# EAGLE schematic Chassis Board V2 (EAGLE 9.1.3)
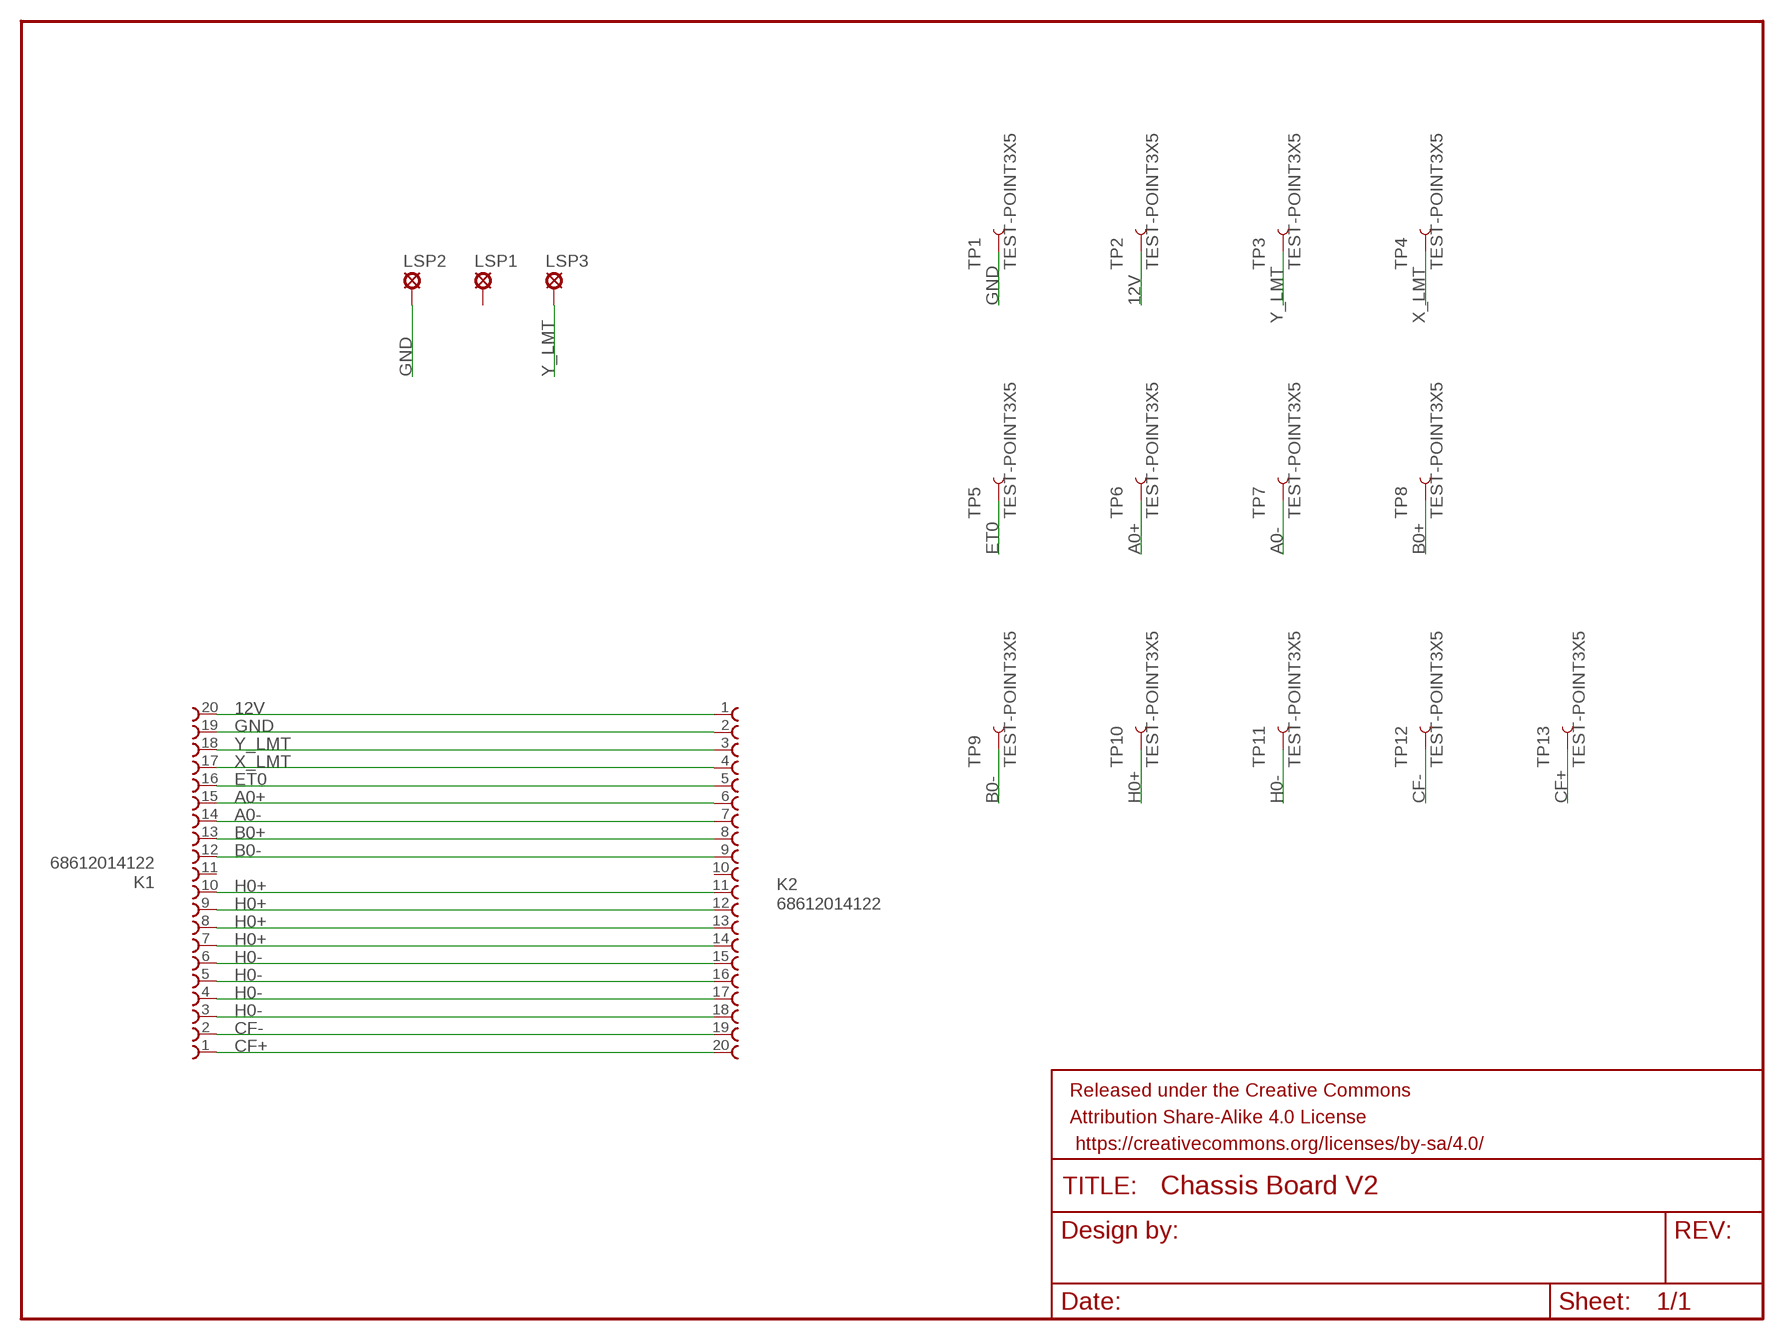
[diagram p0: schematic, sheet 1]

## Parts
FRAME1  FRAME-LETTER  [CREATIVE_COMMONS]
K1  68612014122  [68612014122]
K2  68612014122  [68612014122]
LSP1  NO  LSP13  [LSP13]
LSP2  NC  LSP13  [LSP13]
LSP3  C  LSP13  [LSP13]
TP1  TEST-POINT3X5  [PAD.03X.05]
TP2  TEST-POINT3X5  [PAD.03X.05]
TP3  TEST-POINT3X5  [PAD.03X.05]
TP4  TEST-POINT3X5  [PAD.03X.05]
TP5  TEST-POINT3X5  [PAD.03X.05]
TP6  TEST-POINT3X5  [PAD.03X.05]
TP7  TEST-POINT3X5  [PAD.03X.05]
TP8  TEST-POINT3X5  [PAD.03X.05]
TP9  TEST-POINT3X5  [PAD.03X.05]
TP10  TEST-POINT3X5  [PAD.03X.05]
TP11  TEST-POINT3X5  [PAD.03X.05]
TP12  TEST-POINT3X5  [PAD.03X.05]
TP13  TEST-POINT3X5  [PAD.03X.05]

## Nets
12V: K1.20 K2.1 TP2.P$1
A0+: K1.15 K2.6 TP6.P$1
A0-: K1.14 K2.7 TP7.P$1
B0+: K1.13 K2.8 TP8.P$1
B0-: K1.12 K2.9 TP9.P$1
CF+: K1.1 K2.20 TP13.P$1
CF-: K1.2 K2.19 TP12.P$1
ET0: K1.16 K2.5 TP5.P$1
GND: K1.19 K2.2 LSP2.MP TP1.P$1
H0+: K1.7 K1.8 K1.9 K1.10 K2.11 K2.12 K2.13 K2.14 TP10.P$1
H0-: K1.3 K1.4 K1.5 K1.6 K2.15 K2.16 K2.17 K2.18 TP11.P$1
X_LMT: K1.17 K2.4 TP4.P$1
Y_LMT: K1.18 K2.3 LSP3.MP TP3.P$1
Unconnected: K1.11 K2.10 LSP1.MP

## Library data of the parts
FRAME1 = SparkFun-Aesthetics:FRAME-LETTER: Schematic Frame - Letter Standard 8.5x11 US Letter frame
K1 K2 = Wurth_Elektronik_Electromechanic_FPC_Connectors_&_Flat_Flexible_Cable_rev15b:68612014122: WR-FPC 1.00mm SMT ZIF Horizontal Top Contact, 20 Pins=>Code : Con_FPC_ZIF_1.00_68612014122 <http://katalog.we-online.de/media/images/eican/Con_FPC_ZIF_1.00_6861xx14122_pf2.jpg> Details see: http://katalog.we-online.de/en/em/686_1xx_141_22 Created 2014-07-09, Karrer Zheng 2014 (C) Würth Elektronik
LSP1-LSP3 = solpad:LSP13: SOLDER PAD drill 1.3 mm, distributor Buerklin, 12H562
TP1-TP13 = SparkFun-Connectors:TEST-POINT: SparkFun Test Points Bare copper test points for troubleshooting or In-Circuit-Testing. These are used by our Production team for verifying production board runs using pogo-pins on test beds. SparkFun Products: SparkFun LSM9DS1 Breakout <https://www.sparkfun.com/products/13284> SparkFun PSOC <https://www.sparkfun.com/products/13714> SparkFun Load Cell Amplifier <https://www.sparkfun.com/products/13879>

## Net classes
0 default: width 0.406 mm